# Altium project TinyShuffle v.0a.PrjPcb
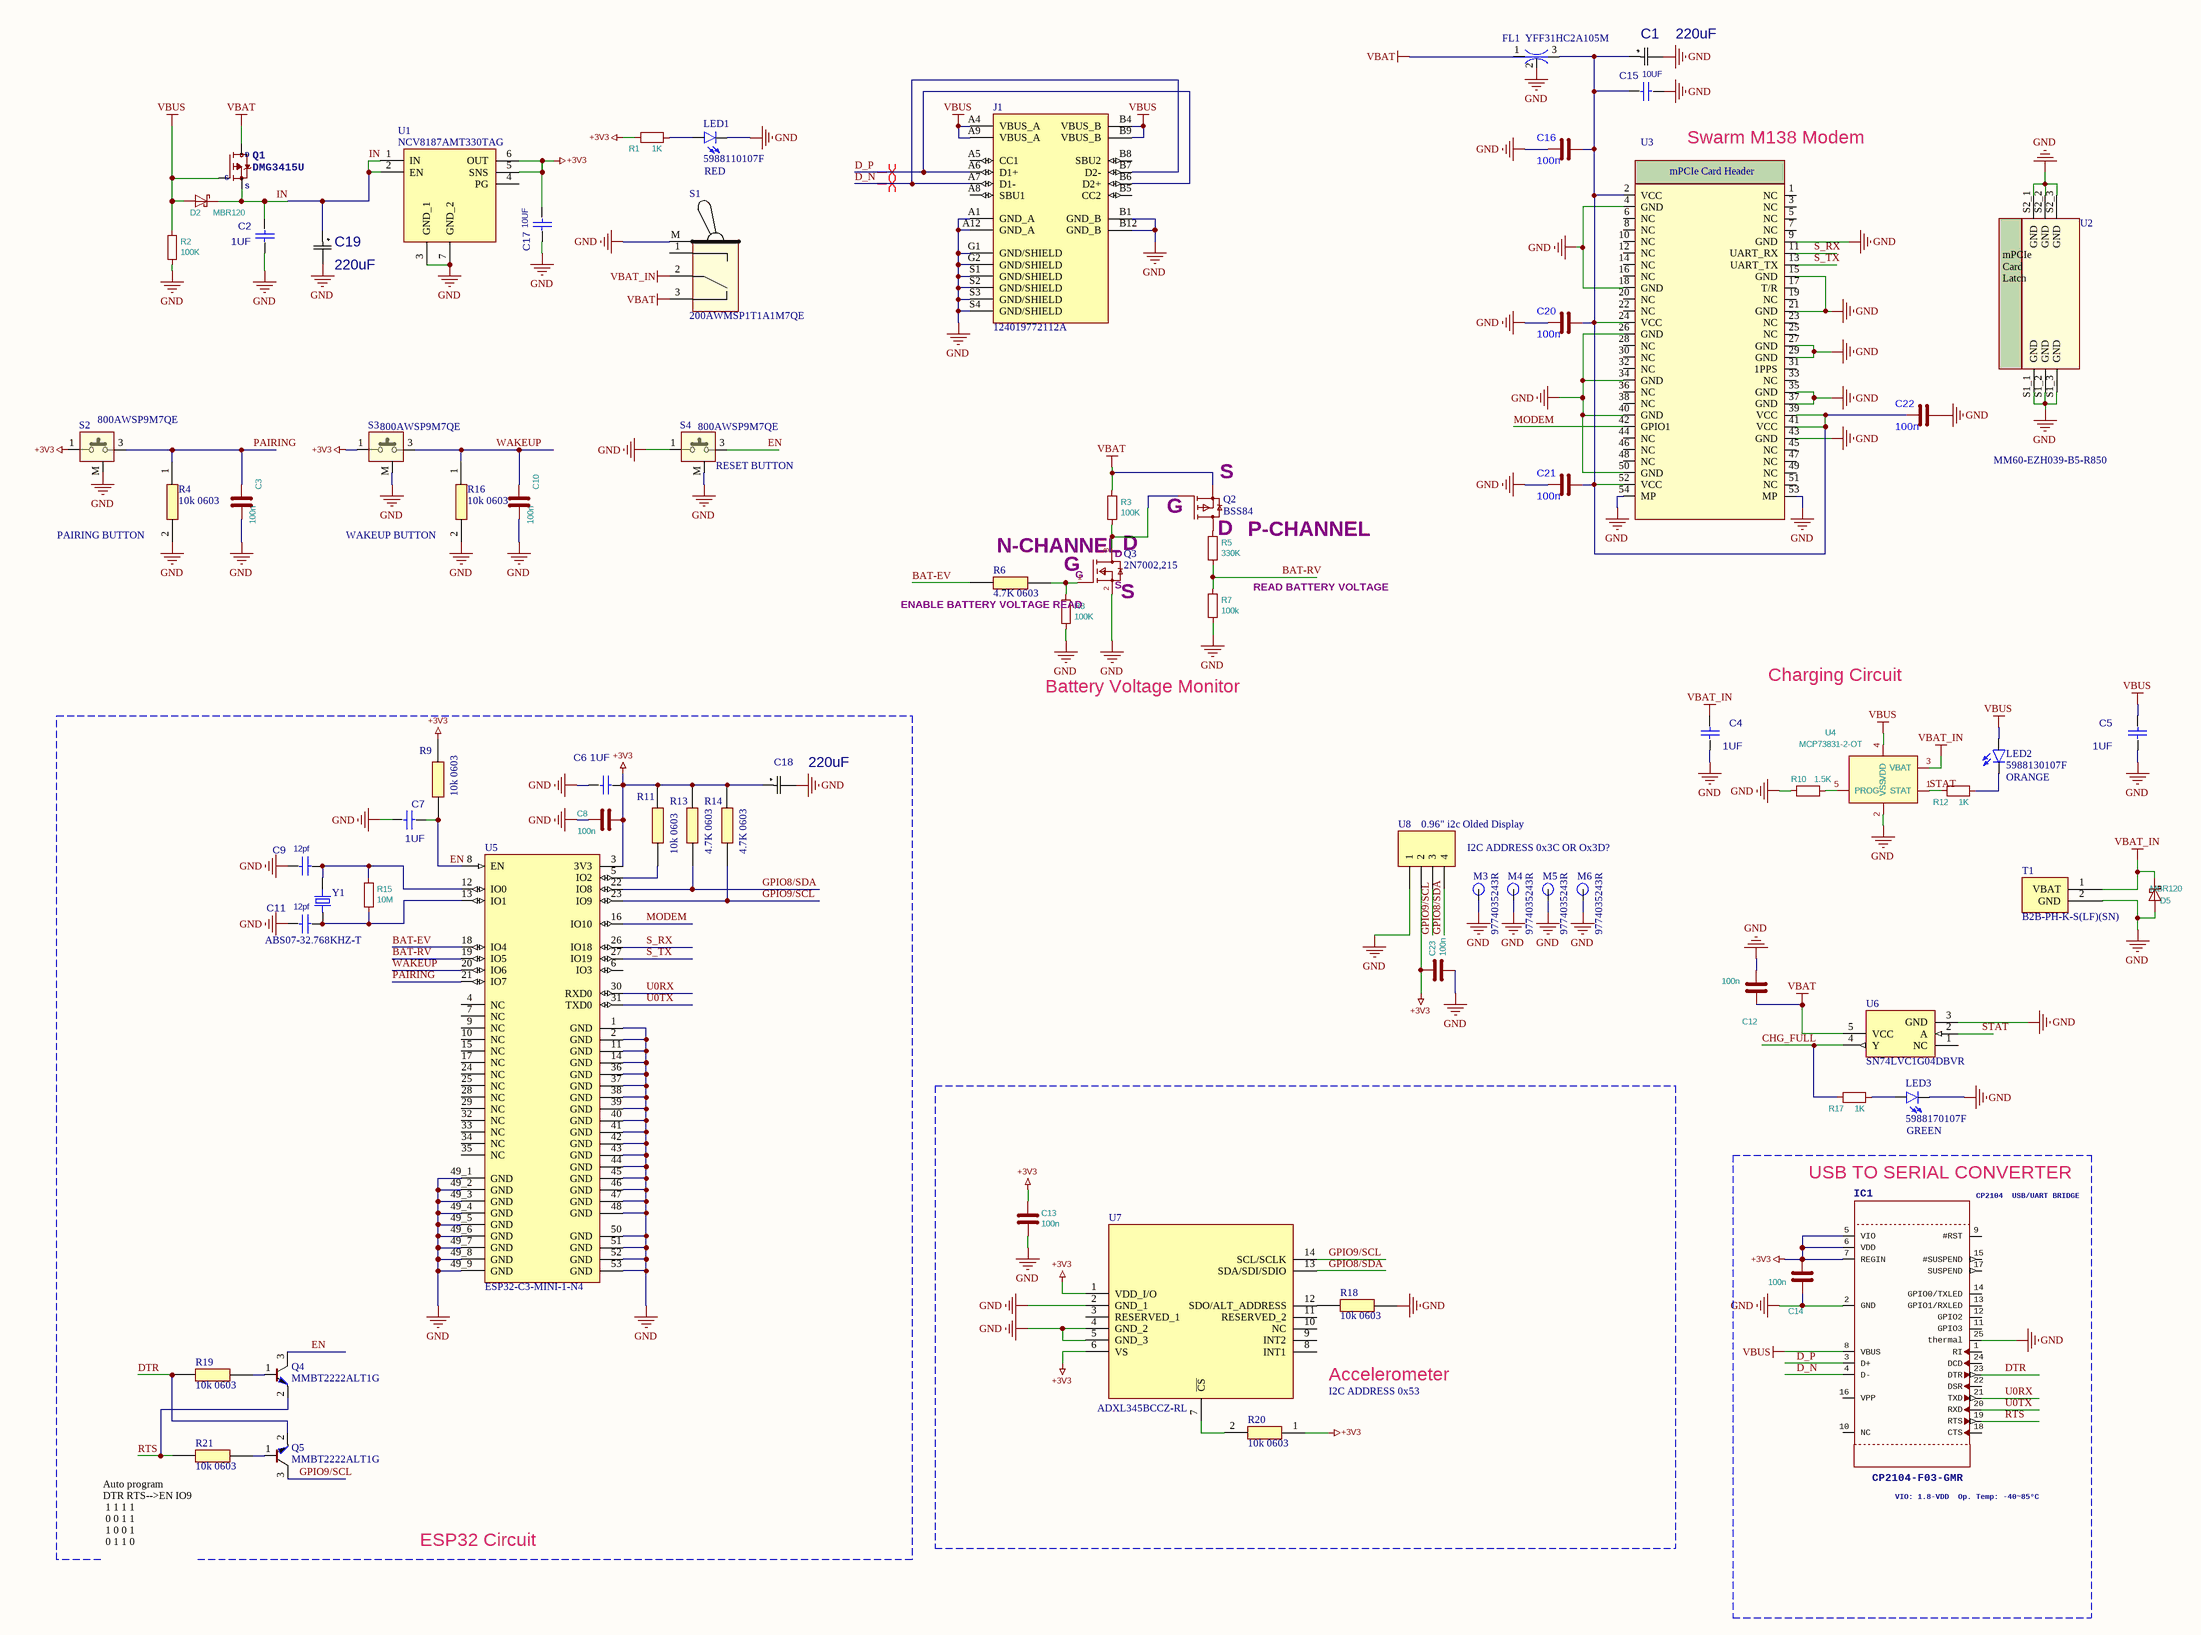
[diagram p0: TinyShuffle v.0a.SchDoc]
1 sheet, 75 parts. Net scope: global (net labels, ports and power ports of the same name join across sheets).
Board file: TinyShuffle v.0a.PcbDoc

## Sheet TinyShuffle v.0a.SchDoc
size C

### Parts
C1  value 220uF  [CHEMI-H70]  (hidden comment: APXA6R3ARA221MH7)
C2  value 1UF  [0603 Capacitor]  (hidden comment: CAPC1608N-1UF)
C3  value 100n  [0603 Capacitor]  (hidden comment: CAPC1608N-0.1UF)
C4  value 1UF  [0603 Capacitor]  (hidden comment: CAPC1608N-1UF)
C5  value 1UF  [0603 Capacitor]  (hidden comment: CAPC1608N-1UF)
C6  value 1UF  [0603 Capacitor]  (hidden comment: CAPC1608N-1UF)
C7  value 1UF  [0603 Capacitor]  (hidden comment: CAPC1608N-1UF)
C8  value 100n  [0603 Capacitor]  (hidden comment: CAPC1608N-0.1UF)
C9  value 12pf  [0603 Capacitor]  (hidden comment: CAPC1608N-12PF)
C10  value 100n  [0603 Capacitor]  (hidden comment: CAPC1608N-0.1UF)
C11  value 12pf  [0603 Capacitor]  (hidden comment: CAPC1608N-12PF)
C12  value 100n  [0603 Capacitor]  (hidden comment: CAPC1608N-0.1UF)
C13  value 100n  [0603 Capacitor]  (hidden comment: CAPC1608N-0.1UF)
C14  value 100n  [0603 Capacitor]  (hidden comment: CAPC1608N-0.1UF)
C15  value 10UF  [0603 Capacitor]  (hidden comment: GRM188R61E106MA73D)
C16  value 100n  [0603 Capacitor]  (hidden comment: CAPC1608N-0.1UF)
C17  value 10UF  [0603 Capacitor]  (hidden comment: GRM188R61E106MA73D)
C18  value 220uF  [CHEMI-H70]  (hidden comment: APXA6R3ARA221MH7)
C19  value 220uF  [CHEMI-H70]  (hidden comment: APXA6R3ARA221MH7)
C20  value 100n  [0603 Capacitor]  (hidden comment: CAPC1608N-0.1UF)
C21  value 100n  [0603 Capacitor]  (hidden comment: CAPC1608N-0.1UF)
C22  value 100n  [0603 Capacitor]  (hidden comment: CAPC1608N-0.1UF)
C23  value 100n  [0603 Capacitor]  (hidden comment: CAPC1608N-0.1UF)
D2  MBR120  [SODFL3616X98N]
D5  MBR120  [SODFL3616X98N]
FL1  YFF31HC2A105M  [FIL_YFF31HC2A105M]
IC1  CP2104-F03-GMR  CP2104
USB/UARTBRIDGE: CP2104 / USB/UART BRIDGE  VIO:1.8-VDD
Op.Temp:-40~85°C: VIO: 1.8-VDD / Op. Temp: -40~85°C  [cp2104]
J1  124019772112A  [AMPHENOL_124019772112A]
LED1  5988110107F  value RED  [LEDC2012X70N]
LED2  5988130107F  value ORANGE  [LEDC2012X70N]
LED3  5988170107F  value GREEN  [LEDC2012X70N]
M3  9774035243R  [9774035243R]
M4  9774035243R  [9774035243R]
M5  9774035243R  [9774035243R]
M6  9774035243R  [9774035243R]
Q1  DMG3415U  [SOT96P237X111-3N]
Q2  BSS84  [SOT96P237X111-3N]
Q3  2N7002,215  [SOT96P237X111-3N]
Q4  MMBT2222ALT1G  [SOT96P237X111-3N]
Q5  MMBT2222ALT1G  [SOT96P237X111-3N]
R1  1K  [RES0603]
R2  100K  [RES0603]
R3  100K  [RES0603]
R4  10k 0603  [RES0603]
R5  330K  [RES0603]
R6  4.7K 0603  [RES0603]
R7  100K  [RES0603]
R8  100K  [RES0603]
R9  10k 0603  [RES0603]
R10  1.5K  [RES0603]
R11  10k 0603  [RES0603]
R12  1K  [RES0603]
R13  4.7K 0603  [RES0603]
R14  4.7K 0603  [RES0603]
R15  10M  [RES0603]
R16  10k 0603  [RES0603]
R17  1K  [RES0603]
R18  10k 0603  [RES0603]
R19  10k 0603  [RES0603]
R20  10k 0603  [RES0603]
R21  10k 0603  [RES0603]
S1  200AWMSP1T1A1M7QE  [200AWMSP1T1A1M7QE]
S2  800AWSP9M7QE  [800AWSP9M7QE]
S3  800AWSP9M7QE  [800AWSP9M7QE]
S4  800AWSP9M7QE  [800AWSP9M7QE]
T1  B2B-PH-K-S(LF)(SN)  [JST_B2B-PH-K-S(LF)(SN)]
U1  NCV8187AMT330TAG  [SON65P200X200X80-7N]
U2  MM60-EZH039-B5-R850  [m.2]
U3  MM60-52B1-B1-R850  [MM60-52B1-B1-R850]  (value not drawn)
U4  value MCP73831-2-OT  [SOT95P270X145-5N]  (hidden comment: MCP73831T-2ACI/OT)
U5  ESP32-C3-MINI-1-N4  [XCVR_ESP32-C3-MINI-1-N4]
U6  SN74LVC1G04DBVR  [SOT95P270X145-5N]
U7  ADXL345BCCZ-RL  [ADXL345BCCZRL]
U8  0.96" i2c Olded Display  [i2c display]
Y1  ABS07-32.768KHZ-T  [XTAL_ABS07-32.768KHZ-T]

### Blocks framed on the sheet
ESP32 Circuit: C6-C9 C11 C18 Q4 Q5 R9 R11 R13-R15 R19 R21 U5 Y1
Accelerometer: C13 R18 R20 U7
USB TO SERIAL CONVERTER: C14 IC1

### Nets
+3V3: C6.2 C8.2 C13.1 C14.2 C17.2 C18.1 C23.1 IC1.5(VIO) IC1.6(VDD) IC1.7(REGIN) R1.2 R9.1 R11.1 R13.1 R14.1 R20.1 S2.1 S3.1 U1.5(SNS) U1.6(OUT) U5.3(3V3) U7.1(VDD_I/O) U7.6(VS) U8.2
GND: C1.2 C2.1 C3.2 C4.2 C5.1 C6.1 C7.1 C8.1 C9.2 C10.2 C11.2 C12.2 C13.2 C14.1 C15.2 C16.2 C17.1 C18.2 C19.2 C20.2 C21.2 C22.1 C23.2 D5.2(A) FL1.2 IC1.2(GND) IC1.25(thermal) J1.A1(GND_A) J1.A12(GND_A) J1.B1(GND_B) J1.B12(GND_B) J1.G1(GND/SHIELD) J1.G2(GND/SHIELD) J1.S1(GND/SHIELD) J1.S2(GND/SHIELD) J1.S3(GND/SHIELD) J1.S4(GND/SHIELD) LED1.C LED3.C M3.M M4.M M5.M M6.M Q3.2(S) R2.2 R4.2 R7.2 R8.2 R10.2 R16.2 R18.1 S1.M S2.M S3.M S4.1 S4.M T1.2(GND) U1.3(GND_1) U1.7(GND_2) U2.S1_1(GND) U2.S1_2(GND) U2.S1_3(GND) U2.S2_1(GND) U2.S2_2(GND) U2.S2_3(GND) U3.4(GND) U3.9(GND) U3.15(GND) U3.18(GND) U3.21(GND) U3.26(GND) U3.27(GND) U3.29(GND) U3.34(GND) U3.35(GND) U3.37(GND) U3.40(GND) U3.43(GND) U3.50(GND) U3.53(MP) U3.54(MP) U4.2(VSS) U5.1(GND) U5.2(GND) U5.11(GND) U5.14(GND) U5.36(GND) U5.37(GND) U5.38(GND) U5.39(GND) U5.40(GND) U5.41(GND) U5.42(GND) U5.43(GND) U5.44(GND) U5.45(GND) U5.46(GND) U5.47(GND) U5.48(GND) U5.49_1(GND) U5.49_2(GND) U5.49_3(GND) U5.49_4(GND) U5.49_5(GND) U5.49_6(GND) U5.49_7(GND) U5.49_8(GND) U5.49_9(GND) U5.50(GND) U5.51(GND) U5.52(GND) U5.53(GND) U6.3(GND) U7.2(GND_1) U7.4(GND_2) U7.5(GND_3) U8.1
VBAT: C12.1 FL1.1(IN/OUT) Q1.3(D) Q2.2(S) R3.1 S1.3 U6.5(VCC)
VBAT_IN: C4.1 D5.1(K) S1.2 T1.1(VBAT) U4.3(VBAT)
VBUS: C5.2 D2.2(A) IC1.8(VBUS) J1.A4(VBUS_A) J1.A9(VBUS_A) J1.B4(VBUS_B) J1.B9(VBUS_B) LED2.A Q1.1(G) R2.1 U4.4(VDD)
BAT-EV: R6.1 U5.18(IO4)
BAT-RV: R5.2 R7.1 U5.19(IO5)
CHG_FULL: R17.2 U6.4(Y)
D_N: IC1.4(D-) J1.A7(D1-) J1.B7(D2-)
D_P: IC1.3(D+) J1.A6(D1+) J1.B6(D2+)
DTR: IC1.23(DTR) Q5.2(E) R19.2
EN: C7.2 Q4.3(C) R9.2 S4.3 U5.8(EN)
GPIO8/SDA: R13.2 U5.22(IO8) U7.13(SDA/SDI/SDIO) U8.4
GPIO9/SCL: Q5.3(C) R14.2 U5.23(IO9) U7.14(SCL/SCLK) U8.3
IN: C2.2 C19.1 D2.1(K) Q1.2(S) U1.1(IN) U1.2(EN)
MODEM: U3.42(GPIO1) U5.16(IO10)
PAIRING: C3.1 R4.1 S2.3 U5.21(IO7)
RTS: IC1.19(RTS) Q4.2(E) R21.2
S_RX: U3.11(UART_RX) U5.26(IO18)
S_TX: U3.13(UART_TX) U5.27(IO19)
STAT: R12.2 U4.1(STAT) U6.2(A)
U0RX: IC1.21(TXD) U5.30(RXD0)
U0TX: IC1.20(RXD) U5.31(TXD0)
WAKEUP: C10.1 R16.1 S3.3 U5.20(IO6)
NetC1_1: C1.1 C15.1 C16.1 C20.1 C21.1 C22.2 FL1.3(OUT/IN) U3.2(VCC) U3.24(VCC) U3.39(VCC) U3.41(VCC) U3.52(VCC)
NetC9_1: C9.1 R15.1 U5.12(IO0) Y1.2
NetC11_1: C11.1 R15.2 U5.13(IO1) Y1.1
NetLED1_A: LED1.A R1.1
NetLED2_C: LED2.C R12.1
NetLED3_A: LED3.A R17.1
NetQ2_1: Q2.1(G) Q3.3(D1) R3.2
NetQ2_3: Q2.3(D) R5.1
NetQ3_1: Q3.1(G) R6.2 R8.1
NetQ4_1: Q4.1(B) R19.1
NetQ5_1: Q5.1(B) R21.1
NetR10_1: R10.1 U4.5(PROG)
NetR11_2: R11.2 U5.5(IO2)
NetR18_2: R18.2 U7.12(SDO/ALT_ADDRESS)
NetR20_2: R20.2 U7.7(~{CS})

Not connected (* = marked no-connect by the designer): IC1 1(RI) 9(#RST) 10(NC) 11(GPIO3) 12(GPIO2) 13(GPIO1/RXLED) 14(GPIO0/TXLED) 15(#SUSPEND) 16(VPP) 17(SUSPEND) 18(CTS) 22(DSR) 24(DCD); J1 A5(CC1) A8(SBU1) B5(CC2) B8(SBU2); S1 1; U1 4(PG); U3 1(NC) 3(NC) 5(NC) 6(NC) 7(NC) 8(NC) 10(NC) 12(NC) 14(NC) 16(NC) 17(T/R) 19(NC) 20(NC) 22(NC) 23(NC) 25(NC) 28(NC) 30(NC) 31(1PPS) 32(NC) 33(NC) 36(NC) 38(NC) 44(NC) 45(NC) 46(NC) 47(NC) 48(NC) 49(NC) 51(NC); U5 4(NC) 6(IO3) 7(NC) 9(NC) 10(NC) 15(NC) 17(NC) 24(NC) 25(NC) 28(NC) 29(NC) 32(NC) 33(NC) 34(NC) 35(NC); U6 1(NC); U7 3(RESERVED_1) 8(INT1) 9(INT2) 10(NC) 11(RESERVED_2)

### Layout directives
differential pair: D_N, D_P

### Notes on the sheet
- Swarm M138 Modem
- (near S4) RESET BUTTON
- (near Q2) S
- PAIRING BUTTON
- WAKEUP BUTTON
- (near Q3) N-CHANNEL
- D
- (near Q2) G
- P-CHANNEL
- ENABLE BATTERY VOLTAGE READ
- G
- (near Q3) S
- READ BATTERY VOLTAGE
- Battery Voltage Monitor
- Charging Circuit
- I2C ADDRESS 0x3C OR Ox3D?
- (near U7) I2C ADDRESS 0x53
- (near R21) Auto program
  DTR RTS-->EN IO9
  1 1 1 1
  0 0 1 1
  1 0 0 1
  0 1 1 0
- (in symbol 2N7002) D
- (in symbol Component_2) mPCIe Card Latch
- (in symbol SWARM_M138_mPCIe_2.005"_VHF) mPCIe Card Header

### Library data of the parts
C1 C18 C19 = APXA6R3ARA221MH7: CAP ALUM POLY 220UF 20% 6.3V SMD; Mfr_Name: Nippon Chemi-Con; Manufacturer_Part_Number: APXA6R3ARA221MH70G; C: Copyright (C) 2015 Accelerated Designs. All rights reserved; Copyright: Copyright (C) 2022 Ultra Librarian. All rights reserved.; Digi-Key_Part_Number_1: 565-3114-1-ND; Digi-Key_Part_Number_2: 565-3114-2-ND; Digi-Key_Part_Number_3: 565-3114-2-NDL; Digi-Key_Part_Number_4: 565-3114-6-ND
C2 C4-C7 = CAPC1608N-0.1UF: CAP CER 1UF 25V X7R 0603; Manufacturer_Name: TDK Corporation; Manufacturer_Part_Number: CGA3E2X7R1E104K080AA; PCB DECAL: CAPC1608X55N; Mouser Part Number: 963-TMF212B7104KGHT; Mouser Price/Stock: https://www2.mouser.com/ProductDetail/Taiyo-Yuden/TMF212B7104KGHT?qs=%252B6g0mu59x7Jv7XISa3hIWA%3D%3D; LCSC Part Number: *
C3 C8 C10 C12-C14 C16 C20-C23 = 100n_0603: CAP CER 0.1UF 25V X7R 0603; Part Number: C0603C104J5RACTU; Generic Part: no; Manufacturer: KEMET; Footprint: Capacitor_SMD:C_0603_1608Metric
  C13 C23: LCSC Part Number: *
C9 C11 = CAPC1608N-0.1UF: CAP CER 12PF NP0 0603; Manufacturer_Name: TDK Corporation; Manufacturer_Part_Number: CGA3E2X7R1E104K080AA; PCB DECAL: CAPC1608X55N; Mouser Part Number: 963-TMF212B7104KGHT; Mouser Price/Stock: https://www2.mouser.com/ProductDetail/Taiyo-Yuden/TMF212B7104KGHT?qs=%252B6g0mu59x7Jv7XISa3hIWA%3D%3D; LCSC Part Number: *
C15 C17 = CAPC1608N-0.1UF: 25V 10UF X5R ±20% 0603 MLCC; Manufacturer_Name: TDK Corporation; Manufacturer_Part_Number: CGA3E2X7R1E104K080AA; PCB DECAL: CAPC1608X55N; Mouser Part Number: 963-TMF212B7104KGHT; Mouser Price/Stock: https://www2.mouser.com/ProductDetail/Taiyo-Yuden/TMF212B7104KGHT?qs=%252B6g0mu59x7Jv7XISa3hIWA%3D%3D; LCSC Part Number: *
D2 D5 = MBR0520: 20V 600mV@1A 1A SOD-123 Schottky Barrier Diodes (SBD) ROHS; Manufacturer_Part_Number: LMBR120FT1G; Generic Part: no; Manufacturer: ON; Value: MBR120; Footprint: Diode_SMD:D_SOD-123; LCSC Part Number: C81143
FL1 = YFF31HC2A105M: 1ÂµF Feed Through Capacitor 100V 6A 5mOhm 1206 (3216 Metric), 4 PC Pad; MF: TDK; MP: YFF31HC2A105M; Package: 0402 TDK; SnapEDA_Link: https://www.snapeda.com/parts/YFF31HC2A105M/TDK/view-part/566442/?ref=snap; Value: *; Check_prices: https://www.snapeda.com/parts/YFF31HC2A105M/TDK/view-part/566442/?ref=eda; Purchase-URL: https://pricing.snapeda.com/search/part/YFF31HC2A105M/?ref=eda; Digi-Key_Part_Number: 445-16151-1-ND
IC1 = CP2104: CP2104 - USB to UART Bridge    VDD Output: 3.45V; COMPANY: ADAFRUIT INDUSTRIES; DRAWN: KTOWN; REV: B; LCSC Part Number: C47742; Manufacturer_Part_Number: CP2104-F03-GMR
J1 = 124019772112A: USB2.0, TOP MOUNT, R/A, 16 PIN, DUAL; MF: Amphenol Commercial Products; Value: *; Availability: Bad; Check_prices: https://www.snapeda.com/parts/124019772112A/Amphenol/view-part/4792123/?ref=eda; SnapEDA_Link: https://www.snapeda.com/parts/124019772112A/Amphenol/view-part/4792123/?ref=snap; Package: None; MP: 124019772112A; Price: None
LED1 = 598_SERIES_LED: Red 635nm LED Indication - Discrete 2.2V 0805 _2012 Metric_; MP: 598-8110-107F; MF: Dialight; SnapEDA_Link: https://www.snapeda.com/parts/598-8110-107F/Dialight/view-part/275124/?ref=snap; Price: None; Package: 0805 Dialight; Availability: Unavailable
LED2 = 598_SERIES_LED: Orange 605nm LED Indication - Discrete 2V 0805 (2012 Metric); MP: 598-8110-107F; MF: Dialight; SnapEDA_Link: https://www.snapeda.com/parts/598-8110-107F/Dialight/view-part/275124/?ref=snap; Price: None; Package: 0805 Dialight; Availability: Unavailable
LED3 = 598_SERIES_LED: Green 566nm LED Indication - Discrete 2V 0805 (2012 Metric); MP: 598-8110-107F; MF: Dialight; SnapEDA_Link: https://www.snapeda.com/parts/598-8110-107F/Dialight/view-part/275124/?ref=snap; Price: None; Package: 0805 Dialight; Availability: Unavailable
M3-M6 = STANDOFF: RND STANDOFF M2X0.4 STEEL 3.5MM
Q1 = MOSFET-P: P-Channel Mosfet   LEGEND   VDS: Voltage Drain-Source ID: Drain Current RDS(ON): Drain-Source On-State Resistance VGS(TH): Gate-Source Threshold Voltage CISS: Drain-Source Input Capacitance    SOT-23   Name	VDS	ID	RDS(ON)	VGS(TH)	CISS	Order Number	   IRLML5103	30V	760mA	600 mOhm	--	75pF @ 25V	Digikey: IRLML5103PBFCT-ND	   IRLML6401	12V	4.3A	50 mOhm	950mV @ 250µA	830pF @ 10V	Digikey: IRLML6401PBFTR-ND	   NTR0202PL	20V	400mA	800 mOhm	2.3V @ 250uA	70pF @ 5V	Digikey: NTR0202PLT1GOSTR-ND	   NTR4101PT1G	20V	1.8A	85 mOhm	1.2V @ 250uA	675pF @ 10V	Digikey: NTR4101PT1GOSCT-ND	   DMP2004K	20V	600mA	900 mOhm	1V @ 250uA	175pF @ 16V	Digikey: DMP2004KDICT-ND	   PMV65XP	20V	3.9A	76 mOhm	950mV @ 1mA	725pF @ 20V	Digikey: 568-2358-2-ND	   							   							TO-252   Name	VDS	ID	RDS(ON)	VGS(TH)	CISS	Order Number	   AOD417	30V	25A	34 mOhm	3V @ 250µA	920pF @ 15V	Digikey: 785-1106-2-ND	PowerPak   Name	VDS	ID	RDS(ON)	VGS(TH)	CISS	Order Number	   AON7401	30V	12A	14 mOhm	3V @ 250µA	2600pF @ 15V	Digikey: 785-1302-1-ND; Manufacturer_Part_Number: DMG3415U-7; COMPANY: ADAFRUIT INDUSTRIES; DRAWN: KTOWN; REV: B; D: D; S: S; G: G; LCSC Part Number: C709946
Q2 = BSS84: MOSFET P-CH 60V 0.17A 3-Pin SOT-23 T/R
Q3 = 2N7002: Power MOSFET, N Channel, 60 V, 300 mA, 2.8 ohm, SOT-23, Surface Mount
Q4 Q5 = MMBT2222ALT1G: Integrated Circuit; Manufacturer_Name: ON Semiconductor; Datasheet Link: http://www.onsemi.com/pub/Collateral/MMBT2222LT1-D.PDF; Height: 1.11mm; Manufacturer_Part_Number: MMBT2222ALT1G; Arrow Part Number: MMBT2222ALT1G; Arrow Price/Stock: https://www.arrow.com/en/products/mmbt2222alt1g/on-semiconductor; Mouser Part Number: 863-MMBT2222ALT1G; Mouser Price/Stock: https://www.mouser.co.uk/ProductDetail/ON-Semiconductor/MMBT2222ALT1G?qs=HVbQlW5zcXWwnD7Jokybqg%3D%3D; LCSC Part Number: C82460
R1 R12 = 1K_0603: RES 1.00K OHM 1/10W 1% 0603 SMD; Manufacturer_Part_Number: CRCW06031K00FKEAHP; Generic Part: no; Manufacturer: Vishay; Value: 1K; Footprint: Resistor_SMD:R_0603_1608Metric; LCSC Part Number: *
R2 R3 R7 R8 = 100K_0603: Res General Purpose Thick Film 0603 100k Ohm 1% 1/10W ±100ppm/°C Molded; Part Number: CRCW0603100KFKEAHP; Generic Part: no; Manufacturer: Vishay; Footprint: Resistor_SMD:R_0603_1608Metric
  R2 R3 R8: Value: 100K
  R7: Value: 100k
R4 R9 R11 R16 R18-R21 = RGA1608P-103-B-T1: RES 10.0K OHM 1/10W 1% 0603 SMD Ro HS; Manufacturer_Name: Susumu; Datasheet Link: https://componentsearchengine.com/Datasheets/1/RGA1608P-103-B-T1.pdf; Height: 0.55mm; Manufacturer_Part_Number: RGA1608P-103-B-T1; Arrow Part Number: RGA1608P-103-B-T1; Mouser Part Number: 754-RGA1608P-103BT1; Mouser Price/Stock: https://www.mouser.co.uk/ProductDetail/Susumu/RGA1608P-103-B-T1?qs=bZr6mbWTK5mMUuFD5Afdcw%3D%3D; LCSC Part Number: *
R5 = 330K_0603: Res Thick Film 0603 330K Ohm 1% 0.1W(1/10W) ±100ppm/C Pad SMD T/R; Part Number: CRCW0603330KFKEAHP; Generic Part: no; Manufacturer: Vishay; Value: 330K; Footprint: Resistor_SMD:R_0603_1608Metric
R6 R13 R14 = RGA1608P-103-B-T1: Res Thick Film 0603 330K Ohm 1% 0.1W(1/10W) ±100ppm/C Pad SMD T/R; Manufacturer_Name: Susumu; Datasheet Link: https://componentsearchengine.com/Datasheets/1/RGA1608P-103-B-T1.pdf; Height: 0.55mm; Manufacturer_Part_Number: RGA1608P-103-B-T1; Arrow Part Number: RGA1608P-103-B-T1; Mouser Part Number: 754-RGA1608P-103BT1; Mouser Price/Stock: https://www.mouser.co.uk/ProductDetail/Susumu/RGA1608P-103-B-T1?qs=bZr6mbWTK5mMUuFD5Afdcw%3D%3D; LCSC Part Number: *
R10 = 10K_0603: Res General Purpose Thick Film 0603 1.5K Ohm 1% 1/10W ±100ppm/°C Molded SMD Paper T/R; Manufacturer_Part_Number: CRCW060310K0FKEAHP; Generic Part: no; Manufacturer: Vishay; Value: 1.5K; Footprint: Resistor_SMD:R_0603_1608Metric; LCSC Part Number: *
R15 = 100K_0603: Res Thick Film 0603 10M Ohm 1% 1/10W ±200ppm/°C Molded SMD SMD Paper T/R; Generic Part: YES; Value: 10M; Footprint: Resistor_SMD:R_0603_1608Metric
R17 = 1K_0603: RES 1.00K OHM 1/10W 1% 0603 SMD; Part Number: CRCW06031K00FKEAHP; Generic Part: no; Manufacturer: Vishay; Value: 1K; Footprint: Resistor_SMD:R_0603_1608Metric; LCSC Part Number: *
S1 = 200AWMSP1T1A1M7QE: SWITCH TOGGLE SPDT 3A 120V
S2-S4 = 800AWSP9M7QE: Pushbutton Switch SPST-NO Standard Through Hole, Right Angle, Vertical
T1 = Battery Connector: Connector Header, PH Series, 2 Position, 2.00mm, Through Hole, Press-Fit, Solder, Natural
U1 = NCV8187AMT330TAG: 1.2A LDO Regulator, Low Dropout Voltage, Low Noise with Power Good Output 3.3V, Active discharge; Manufacturer_Name: ON Semiconductor; Datasheet Link: https://www.onsemi.com/pdf/datasheet/ncv8187-d.pdf; Height: 0.8mm; Manufacturer_Part_Number: NCV8187AMT330TAG; Mouser Part Number: 863-NCV8187AMT330TAG; Mouser Price/Stock: https://www.mouser.co.uk/ProductDetail/onsemi/NCV8187AMT330TAG?qs=%252B6g0mu59x7JkSKBMOiGIwA%3D%3D; Arrow Part Number: NCV8187AMT330TAG; Arrow Price/Stock: https://www.arrow.com/en/products/ncv8187amt330tag/on-semiconductor?region=nac
U2 = Component_2: CONN MINI EXPRESS CARD LATCH SMD
U3 = SWARM_M138_mPCIe_2.005"_VHF: SWARM M138 MODEM mPCIe 2.005" (50.925mm) x 1.18" (30mm)  Two part connector; MANUF1: JAE; SPECIAL_INSTRUCTIONS: A: MM60-52B1-B1-R850 B: MM60-EZH039-B5-R850; TEMP: -40°C ~ 85°C; Size: mPCIe; Supplier: Digikey; Supplier P/N: A: 670-2274-2-ND B: 670-2276-2-ND; Type: CONN; MANUF1 P/N: A: MM60-52B1-B1-R850 B: MM60-EZH039-B5-R850
U4 = MCP73831-2-OT: IC BATT CNTL LI-ION 1CEL SOT23-5; Generic Part: no; Manufacturer: Microchip Technology; Manufacturer_Part_Number: MCP73831T-2ACI/OT; Footprint: Package_TO_SOT_SMD:SOT-23-5; LCSC Part Number: *
U5 = ESP32-C3-MINI-1-N4: Bluetooth, WiFi 802.11b/g/n, Bluetooth v5.0 Transceiver Module 2.412GHz ~ 2.484GHz PCB Trace Surface Mount; MF: Espressif Systems; Purchase-URL: https://pricing.snapeda.com/search/part/ESP32-C3-MINI-1-N4/?ref=eda; Value: *; Package: SMD-53 Espressif Systems; Check_prices: https://www.snapeda.com/parts/ESP32-C3-MINI-1-N4/Espressif+Systems/view-part/?ref=eda; Price: None; Availability: In Stock; MP: ESP32-C3-MINI-1-N4; SnapEDA_Link: https://www.snapeda.com/parts/ESP32-C3-MINI-1-N4/Espressif+Systems/view-part/?ref=snap
U6 = SN74LVC1G04DBVR: Inverter IC 1 Channel - SOT-23-5; Manufacturer_Name: Texas Instruments; Datasheet Link: http://www.ti.com/lit/gpn/sn74lvc1g04; Height: 1.45mm; Manufacturer_Part_Number: SN74LVC1G04DBVR; Arrow Part Number: SN74LVC1G04DBVR; Arrow Price/Stock: https://www.arrow.com/en/products/sn74lvc1g04dbvr/texas-instruments; Mouser Part Number: 595-SN74LVC1G04DBVR; Mouser Price/Stock: https://www.mouser.co.uk/ProductDetail/Texas-Instruments/SN74LVC1G04DBVR?qs=AMJt07B76utiScZvQx5a7w%3D%3D; LCSC Part Number: C7827
U7 = ADXL345BCCZ-RL: 3-Axis, ±2 g/±4 g/±8 g/±16 g Digital Accelerometer; Manufacturer_Name: Analog Devices; Datasheet Link: https://www.analog.com/media/en/technical-documentation/data-sheets/ADXL345.pdf; Height: 1mm; Manufacturer_Part_Number: ADXL345BCCZ-RL; Mouser Part Number: 584-ADXL345BCCZ-R; Mouser Price/Stock: https://www.mouser.co.uk/ProductDetail/Analog-Devices/ADXL345BCCZ-RL?qs=WIvQP4zGangSXrz9XHbgiA%3D%3D; Arrow Part Number: ADXL345BCCZ-RL; Arrow Price/Stock: https://www.arrow.com/en/products/adxl345bccz-rl/analog-devices?region=nac
U8 = Header 4: Header, 4-Pin; LatestRevisionDate: 17-Jul-2002; LatestRevisionNote: Re-released for DXP Platform.; Publisher: Altium Limited
Y1 = ABS07-32.768KHZ-T: 32.768kHz Â±20ppm Crystal 12.5pF 70 kOhms 2-SMD, No Lead; MF: Abracon LLC; Price: None; Value: *; Package: SMD-2 Abracon; Availability: Unavailable; SnapEDA_Link: https://www.snapeda.com/parts/ABS07-32.768KHZ/Abracon%20LLC/view-part/448682/?ref=snap; MP: ABS07-32.768KHZ